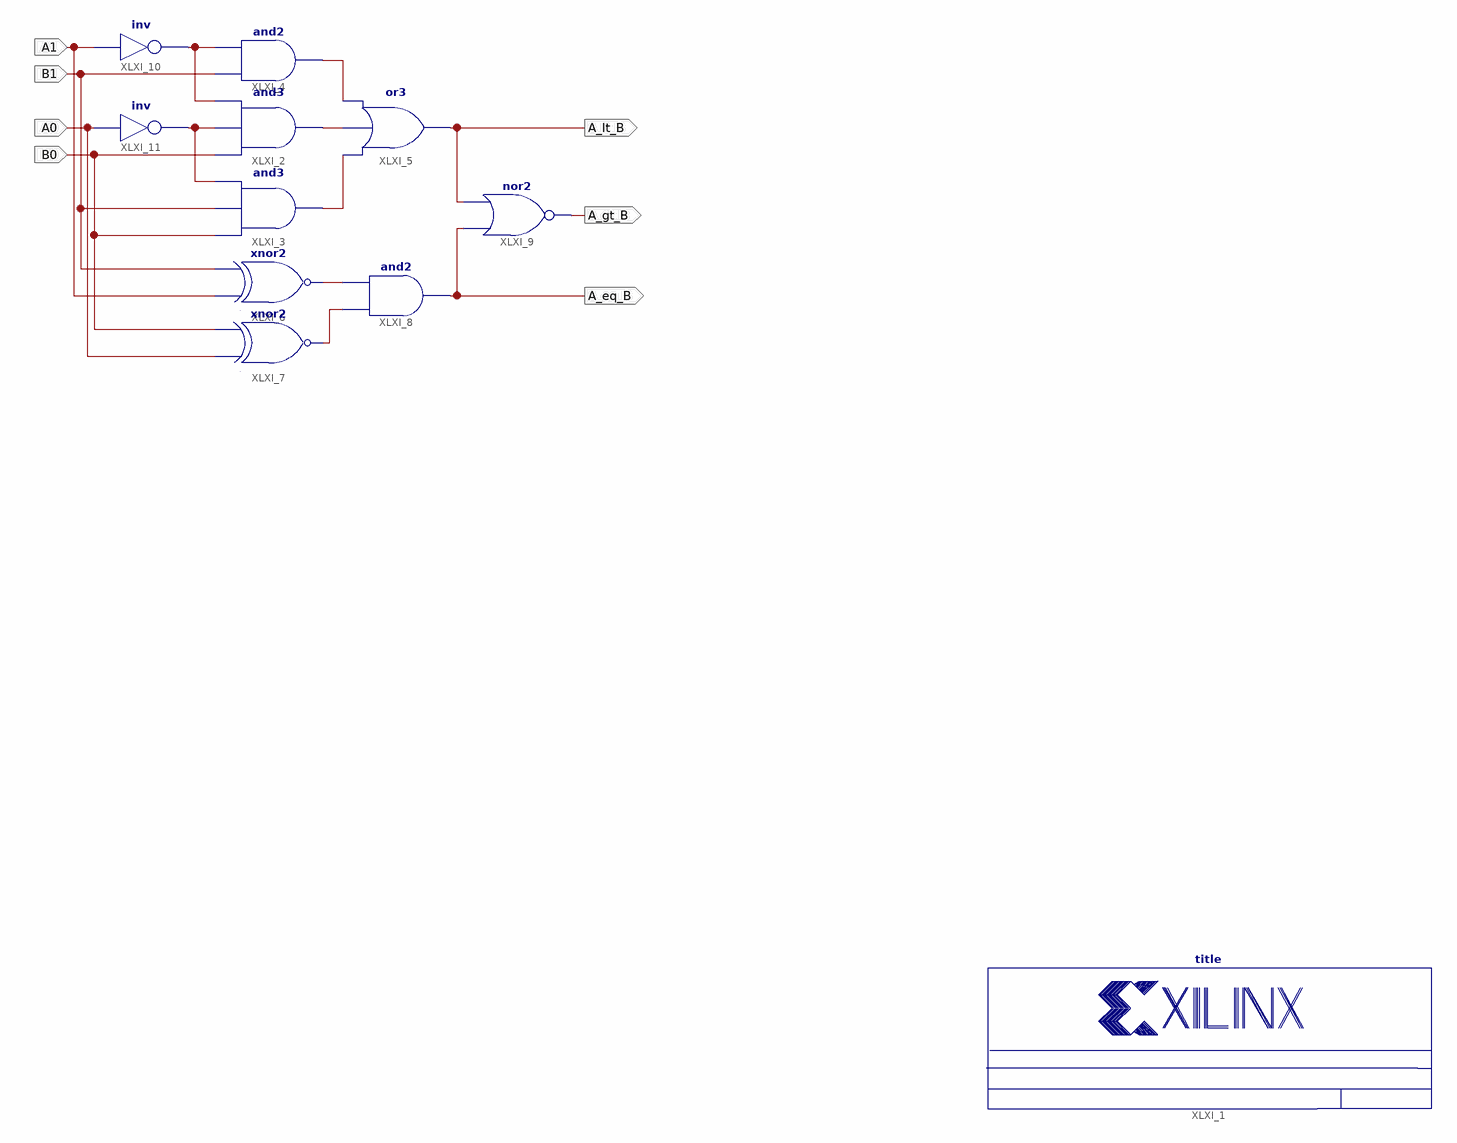
[diagram p0: schematic sheet 1]
// Xilinx ISE schematic fig_4_10.sch (spartan3e) as structural Verilog: 11 symbols, 7 ports
module fig_4_10 (
  input  A1,
  input  B1,
  input  A0,
  input  B0,
  output A_lt_B,
  output A_eq_B,
  output A_gt_B
);

  wire XLXN_1, XLXN_11, XLXN_12, XLXN_13, XLXN_14, XLXN_15, XLXN_16;

  title #(.TitleFieldText("2-bit binary comparator"), .NameFieldText("Figure 4-10")) XLXI_1 ();
  and XLXI_4 (XLXN_15, B1, XLXN_1);
  and XLXI_2 (XLXN_14, B0, XLXN_11, XLXN_1);
  and XLXI_3 (XLXN_16, B0, B1, XLXN_11);
  not XLXI_11 (XLXN_11, A0);
  not XLXI_10 (XLXN_1, A1);
  xnor XLXI_6 (XLXN_12, A1, B1);
  xnor XLXI_7 (XLXN_13, A0, B0);
  or XLXI_5 (A_lt_B, XLXN_16, XLXN_14, XLXN_15);
  nor XLXI_9 (A_gt_B, A_eq_B, A_lt_B);
  and XLXI_8 (A_eq_B, XLXN_13, XLXN_12);
endmodule
